# EAGLE board rgb-32x16-board (EAGLE 9.4.2), part 1 of 2
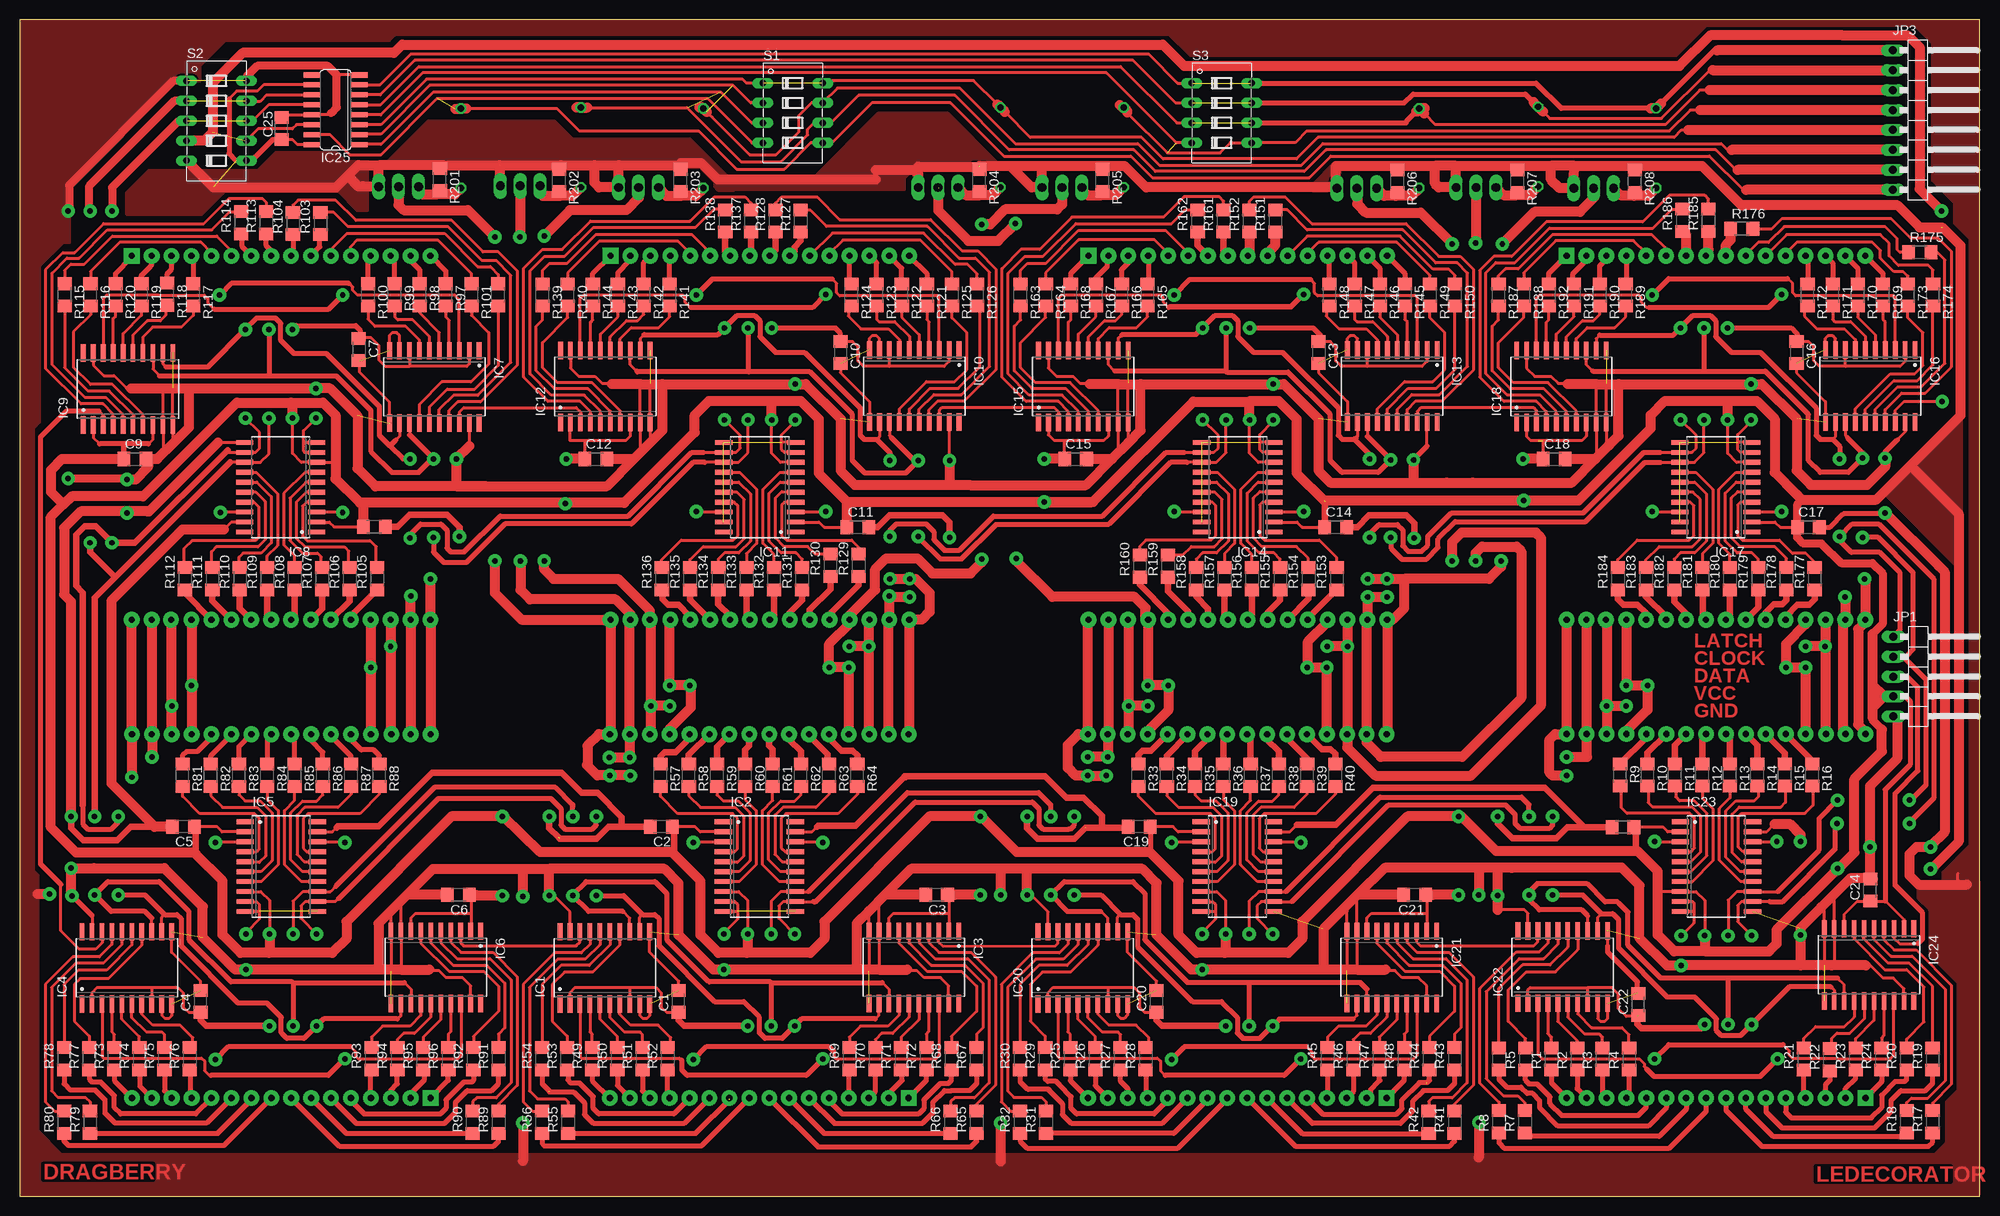
[diagram p2: board, top side]
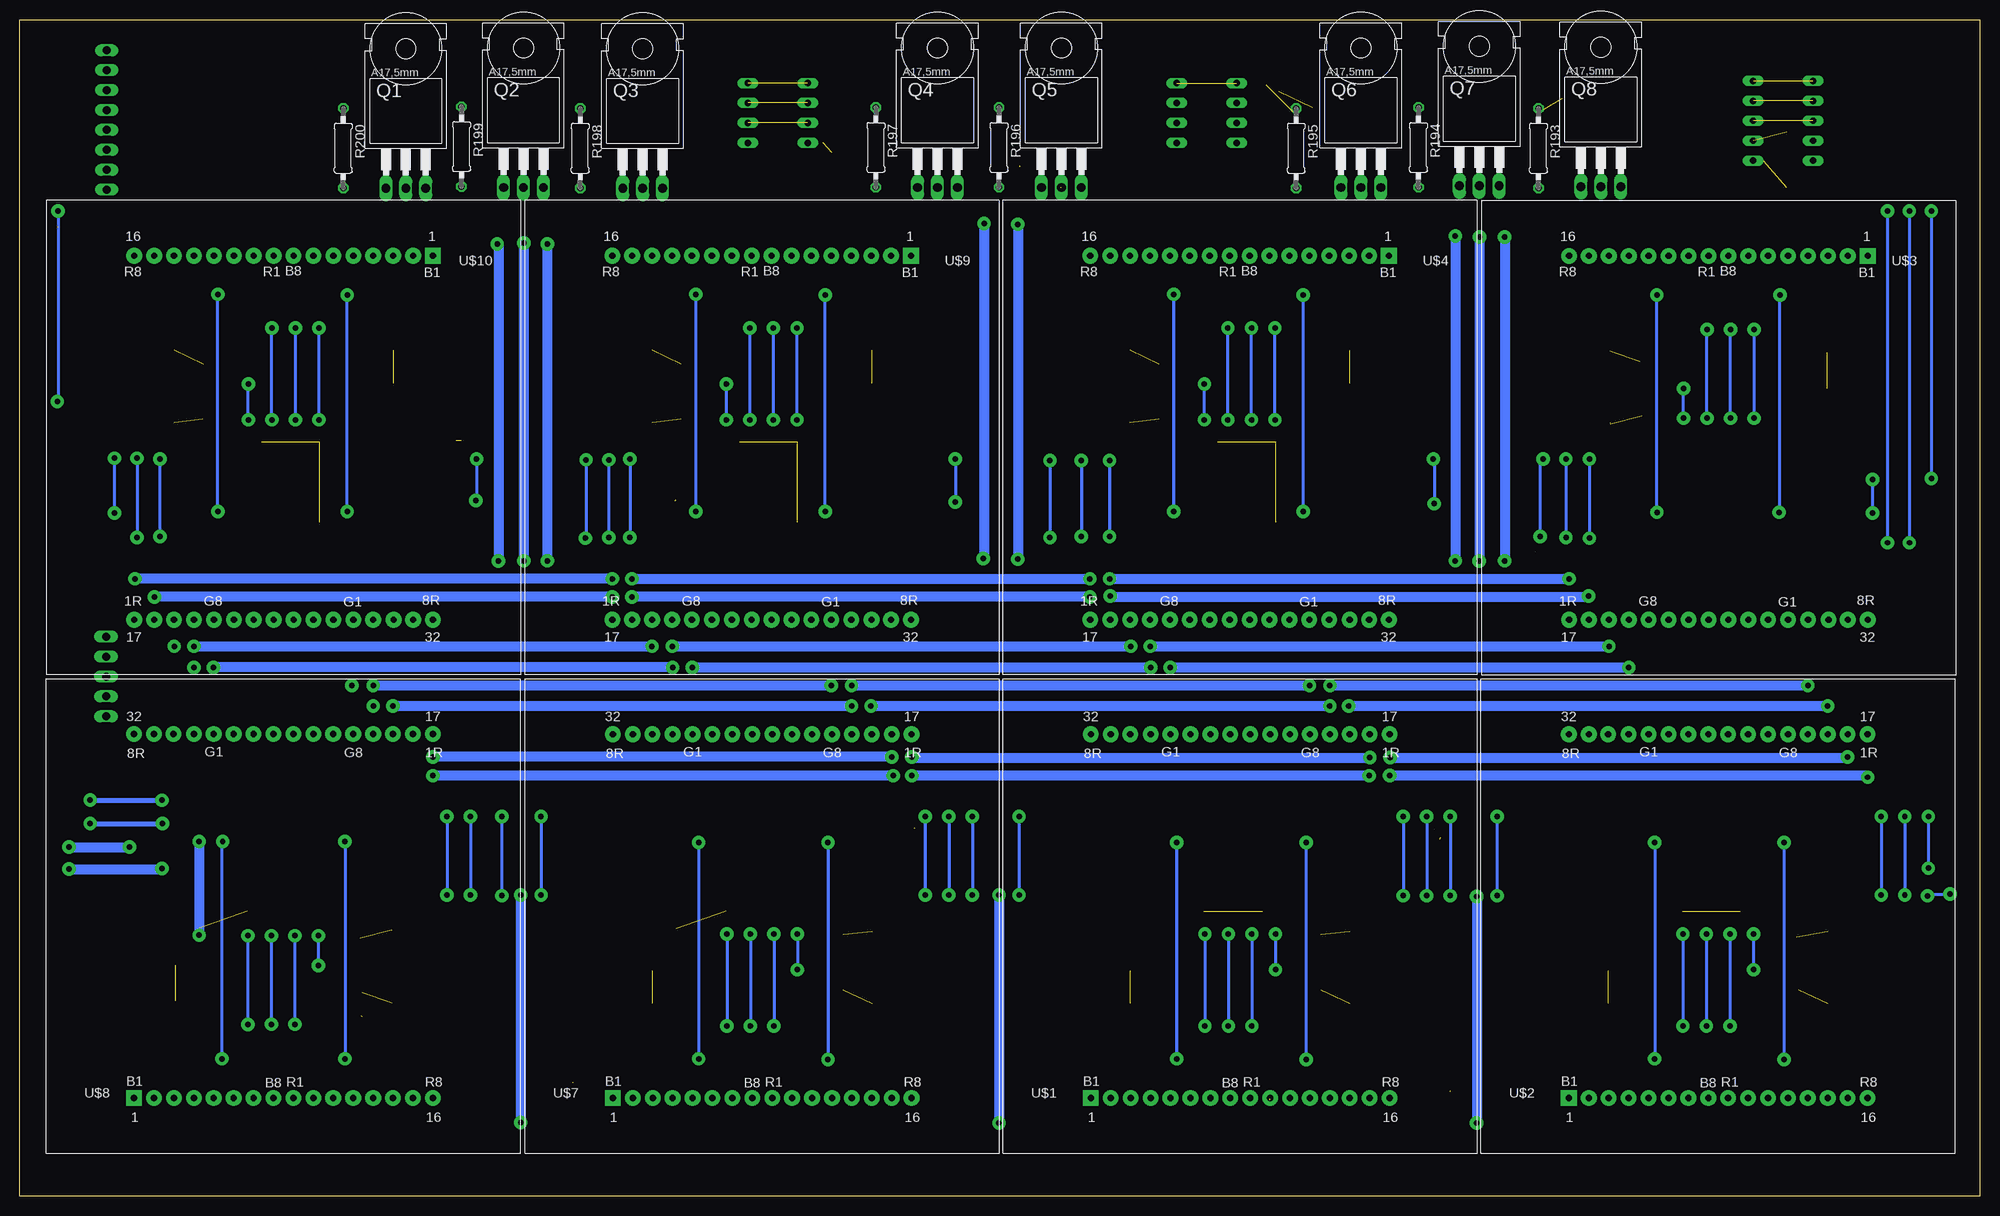
[diagram p3: board, bottom side, seen from below]

Size 250 x 150 mm. Coordinates in mm from the lower left corner, seen from the top.
Outline: 0,0 250,0 250,150 0,150 0,0
Copper layers (1*16): Top 0.035mm / dielectric 1.5mm / Bottom 0.035mm
Design rules "default *": minimum track width 0.3mm, minimum drill 0.7mm, track to track 0.3mm, track to pad 0.3mm, pad to pad 0.3mm, via to via 0.3mm, smd to smd 0.3mm, copper to edge 0mil, drill to drill 0.3mm, minimum pad ring 10mil, minimum via ring 0.5mm, stop-mask expansion 4mil, vias tented up to drill 0mil, thermal gap 10mil

## Footprints (pad centres in the part's own frame; a part is rotated, then mirrored left to right if it is on the bottom)
C1206 = smd 1.6 x 1.8: 1 -1.4,0; 2 1.4,0
SO20W = smd 0.6 x 2.2: 1 -5.715,-4.6; 2 -4.445,-4.6; 3 -3.175,-4.6; 4 -1.905,-4.6; 5 -0.635,-4.6; 6 0.635,-4.6; 7 1.905,-4.6; 8 3.175,-4.6; 9 4.445,-4.6; 10 5.715,-4.6; 11 5.715,4.6; 12 4.445,4.6; 13 3.175,4.6; 14 1.905,4.6; 15 0.635,4.6; 16 -0.635,4.6; 17 -1.905,4.6; 18 -3.175,4.6; 19 -4.445,4.6; 20 -5.715,4.6
SO16 = smd 0.66 x 2.032: 1 -4.445,-3.073; 2 -3.175,-3.073; 3 -1.905,-3.073; 4 -0.635,-3.073; 5 0.635,-3.073; 6 1.905,-3.073; 7 3.175,-3.073; 8 4.445,-3.073; 9 4.445,3.073; 10 3.175,3.073; 11 1.905,3.073; 12 0.635,3.073; 13 -0.635,3.073; 14 -1.905,3.073; 15 -3.175,3.073; 16 -4.445,3.073
1X05/90 = drill 1.016 long: 1 -5.08,-3.81; 2 -2.54,-3.81; 3 0,-3.81; 4 2.54,-3.81; 5 5.08,-3.81
1X08/90 = drill 1.016 long: 1 -8.89,-3.81; 2 -6.35,-3.81; 3 -3.81,-3.81; 4 -1.27,-3.81; 5 1.27,-3.81; 6 3.81,-3.81; 7 6.35,-3.81; 8 8.89,-3.81
TO220BH = drill 1.118 long: D 0,-6.35; G -2.54,-6.35; S 2.54,-6.35
R1206 = smd 1.6 x 1.803: 1 -1.422,0; 2 1.422,0
0207/10 = drill 0.813 octagon: 1 -5.08,0; 2 5.08,0
DIP04YL = drill 0.813 long: 1 -3.81,-3.81; 2 -1.27,-3.81; 3 1.27,-3.81; 4 3.81,-3.81; 5 3.81,3.81; 6 1.27,3.81; 7 -1.27,3.81; 8 -3.81,3.81
DIP05YL = drill 0.813 long: 1 -5.08,-3.81; 2 -2.54,-3.81; 3 0,-3.81; 4 2.54,-3.81; 5 5.08,-3.81; 6 5.08,3.81; 7 2.54,3.81; 8 0,3.81; 9 -2.54,3.81; 10 -5.08,3.81
2088-RGB-5 = drill 0.8 pad 2 square: P$1 0,0 | drill 0.8 pad 2: P$2 2.54,0; P$3 5.08,0; P$4 7.62,0; P$5 10.16,0; P$6 12.7,0; P$7 15.24,0; P$8 17.78,0; P$9 20.32,0; P$10 22.86,0; P$11 25.4,0; P$12 27.94,0; P$13 30.48,0; P$14 33.02,0; P$15 35.56,0; P$16 38.1,0; P$17 38.1,46.4; P$18 35.56,46.4; P$19 33.02,46.4; P$20 30.48,46.4; P$21 27.94,46.4; P$22 25.4,46.4; P$23 22.86,46.4; P$24 20.32,46.4; P$25 17.78,46.4; P$26 15.24,46.4; P$27 12.7,46.4; P$28 10.16,46.4; P$29 7.62,46.4; P$30 5.02,46.4; P$31 2.54,46.4; P$32 0,46.4

## Placement (x,y rotation side)
C1  [C1206]  84.05,24.84 90 top
C2  [C1206]  81.84,47.08 180 top
C3  [C1206]  116.94,38.4 180 top
C4  [C1206]  23.09,24.84 90 top
C5  [C1206]  20.88,47.08 180 top
C6  [C1206]  55.98,38.4 180 top
C7  [C1206]  43.26,107.96 270 top
C8  [C1206]  45.23,85.35 0 top
C9  [C1206]  14.7,93.98 0 top
C10  [C1206]  104.69,107.54 270 top
C11  [C1206]  106.9,85.3 0 top
C12  [C1206]  73.5,93.98 0 top
C13  [C1206]  165.65,107.54 270 top
C14  [C1206]  167.86,85.3 0 top
C15  [C1206]  134.66,93.98 0 top
C16  [C1206]  226.61,107.54 270 top
C17  [C1206]  228.12,85.3 0 top
C18  [C1206]  195.72,93.98 0 top
C19  [C1206]  142.8,47.08 180 top
C20  [C1206]  145.01,24.84 90 top
C21  [C1206]  177.9,38.4 180 top
C22  [C1206]  206.44,24.42 90 top
C23  [C1206]  204.47,47.03 180 top
C24  [C1206]  236,39 90 top
C25  [C1206]  33.4,136.1 90 top
IC1  TPIC6B595DW  [SO20W]  74.64,29.1 0 top
IC2  TPIC6B595DW  [SO20W]  94.34,42 270 top
IC3  TPIC6B595DW  [SO20W]  114.04,29.16 180 top
IC4  TPIC6B595DW  [SO20W]  13.68,29.1 0 top
IC5  TPIC6B595DW  [SO20W]  33.38,42 270 top
IC6  TPIC6B595DW  [SO20W]  53.08,29.16 180 top
IC7  TPIC6B595DW  [SO20W]  52.9,103.18 180 top
IC8  TPIC6B595DW  [SO20W]  33.3,90.38 90 top
IC9  TPIC6B595DW  [SO20W]  13.84,102.9 0 top
IC10  TPIC6B595DW  [SO20W]  114.1,103.28 180 top
IC11  TPIC6B595DW  [SO20W]  94.4,90.38 90 top
IC12  TPIC6B595DW  [SO20W]  74.7,103.22 0 top
IC13  TPIC6B595DW  [SO20W]  175.06,103.28 180 top
IC14  TPIC6B595DW  [SO20W]  155.36,90.38 90 top
IC15  TPIC6B595DW  [SO20W]  135.66,103.22 0 top
IC16  TPIC6B595DW  [SO20W]  236.02,103.28 180 top
IC17  TPIC6B595DW  [SO20W]  216.32,90.38 90 top
IC18  TPIC6B595DW  [SO20W]  196.62,103.22 0 top
IC19  TPIC6B595DW  [SO20W]  155.3,42 270 top
IC20  TPIC6B595DW  [SO20W]  135.6,29.1 0 top
IC21  TPIC6B595DW  [SO20W]  175,29.16 180 top
IC22  TPIC6B595DW  [SO20W]  196.8,29.2 0 top
IC23  TPIC6B595DW  [SO20W]  216.4,42 270 top
IC24  TPIC6B595DW  [SO20W]  235.86,29.48 180 top
IC25  74HC595D  [SO16]  40.3,138.5 90 top
JP1  [1X05/90]  242.77,66.24 270 top
JP3  [1X08/90]  242.7,137.2 270 top
Q1  IRF4905  [TO220BH]  200.74,134.85 0 bottom
Q2  IRF4905  [TO220BH]  185.74,134.95 0 bottom
Q3  IRF4905  [TO220BH]  170.54,134.85 0 bottom
Q4  IRF4905  [TO220BH]  132.94,134.95 0 bottom
Q5  IRF4905  [TO220BH]  117.14,134.95 0 bottom
Q6  IRF4905  [TO220BH]  78.94,134.95 0 bottom
Q7  IRF4905  [TO220BH]  63.84,135.15 0 bottom
Q8  IRF4905  [TO220BH]  48.34,135.05 0 bottom
R1  [R1206]  195.36,17.48 90 top
R2  [R1206]  198.66,17.48 90 top
R3  [R1206]  201.86,17.48 90 top
R4  [R1206]  205.26,17.48 90 top
R5  [R1206]  192.06,17.48 90 top
R6  [R1206]  188.66,17.48 90 top
R7  [R1206]  191.96,9.48 90 top
R8  [R1206]  188.66,9.48 90 top
R9  [R1206]  204.11,53.68 270 top
R10  [R1206]  207.61,53.68 270 top
R11  [R1206]  211.11,53.68 270 top
R12  [R1206]  214.61,53.68 270 top
R13  [R1206]  218.11,53.68 270 top
R14  [R1206]  221.61,53.68 270 top
R15  [R1206]  225.11,53.68 270 top
R16  [R1206]  228.61,53.68 270 top
R17  [R1206]  243.96,9.48 90 top
R18  [R1206]  240.66,9.48 90 top
R19  [R1206]  243.96,17.48 90 top
R20  [R1206]  240.66,17.48 90 top
R21  [R1206]  227.56,17.48 90 top
R22  [R1206]  230.86,17.38 90 top
R23  [R1206]  234.16,17.48 90 top
R24  [R1206]  237.46,17.48 90 top
R25  [R1206]  134,17.5 90 top
R26  [R1206]  137.2,17.5 90 top
R27  [R1206]  140.4,17.5 90 top
R28  [R1206]  143.6,17.5 90 top
R29  [R1206]  130.8,17.5 90 top
R30  [R1206]  127.6,17.5 90 top
R31  [R1206]  130.9,9.4 90 top
R32  [R1206]  127.6,9.4 90 top
R33  [R1206]  142.7,53.66 270 top
R34  [R1206]  146.3,53.66 270 top
R35  [R1206]  149.9,53.66 270 top
R36  [R1206]  153.5,53.66 270 top
R37  [R1206]  157,53.66 270 top
R38  [R1206]  160.6,53.66 270 top
R39  [R1206]  164.2,53.66 270 top
R40  [R1206]  167.8,53.66 270 top
R41  [R1206]  183,9.4 90 top
R42  [R1206]  179.7,9.4 90 top
R43  [R1206]  183,17.5 90 top
R44  [R1206]  179.8,17.5 90 top
R45  [R1206]  166.8,17.5 90 top
R46  [R1206]  170.1,17.5 90 top
R47  [R1206]  173.4,17.5 90 top
R48  [R1206]  176.6,17.5 90 top
R49  [R1206]  73.04,17.5 90 top
R50  [R1206]  76.24,17.5 90 top
R51  [R1206]  79.44,17.5 90 top
R52  [R1206]  82.64,17.5 90 top
R53  [R1206]  69.84,17.5 90 top
R54  [R1206]  66.64,17.5 90 top
R55  [R1206]  69.94,9.4 90 top
R56  [R1206]  66.64,9.4 90 top
R57  [R1206]  81.74,53.66 270 top
R58  [R1206]  85.34,53.66 270 top
R59  [R1206]  88.94,53.66 270 top
R60  [R1206]  92.54,53.66 270 top
R61  [R1206]  96.04,53.66 270 top
R62  [R1206]  99.64,53.66 270 top
R63  [R1206]  103.24,53.66 270 top
R64  [R1206]  106.84,53.66 270 top
R65  [R1206]  122.04,9.4 90 top
R66  [R1206]  118.74,9.4 90 top
R67  [R1206]  122.04,17.5 90 top
R68  [R1206]  118.84,17.5 90 top
R69  [R1206]  105.84,17.5 90 top
R70  [R1206]  109.14,17.5 90 top
R71  [R1206]  112.44,17.5 90 top
R72  [R1206]  115.64,17.5 90 top
R73  [R1206]  12.08,17.5 90 top
R74  [R1206]  15.28,17.5 90 top
R75  [R1206]  18.48,17.5 90 top
R76  [R1206]  21.68,17.5 90 top
R77  [R1206]  8.88,17.5 90 top
R78  [R1206]  5.68,17.5 90 top
R79  [R1206]  8.98,9.4 90 top
R80  [R1206]  5.68,9.4 90 top
R81  [R1206]  20.78,53.66 270 top
R82  [R1206]  24.38,53.66 270 top
R83  [R1206]  27.98,53.66 270 top
R84  [R1206]  31.58,53.66 270 top
R85  [R1206]  35.08,53.66 270 top
R86  [R1206]  38.68,53.66 270 top
R87  [R1206]  42.28,53.66 270 top
R88  [R1206]  45.88,53.66 270 top
R89  [R1206]  61.08,9.4 90 top
R90  [R1206]  57.78,9.4 90 top
R91  [R1206]  61.08,17.5 90 top
R92  [R1206]  57.88,17.5 90 top
R93  [R1206]  44.88,17.5 90 top
R94  [R1206]  48.18,17.5 90 top
R95  [R1206]  51.48,17.5 90 top
R96  [R1206]  54.68,17.5 90 top
R97  [R1206]  54.34,114.9 270 top
R98  [R1206]  51.04,114.9 270 top
R99  [R1206]  47.84,114.9 270 top
R100  [R1206]  44.44,114.9 270 top
R101  [R1206]  57.64,114.9 270 top
R102  [R1206]  61.04,114.9 270 top
R103  [R1206]  38.36,124 90 top
R104  [R1206]  34.86,124 90 top
R105  [R1206]  45.59,78.7 90 top
R106  [R1206]  42.09,78.7 90 top
R107  [R1206]  38.59,78.7 90 top
R108  [R1206]  35.09,78.7 90 top
R109  [R1206]  31.59,78.7 90 top
R110  [R1206]  28.09,78.7 90 top
R111  [R1206]  24.59,78.7 90 top
R112  [R1206]  21.09,78.7 90 top
R113  [R1206]  31.46,124.1 90 top
R114  [R1206]  28.26,124.1 90 top
R115  [R1206]  5.74,114.9 270 top
R116  [R1206]  9.04,114.9 270 top
R117  [R1206]  22.14,114.9 270 top
R118  [R1206]  18.84,115 270 top
R119  [R1206]  15.54,114.9 270 top
R120  [R1206]  12.24,114.9 270 top
R121  [R1206]  115.7,114.88 270 top
R122  [R1206]  112.5,114.88 270 top
R123  [R1206]  109.3,114.88 270 top
R124  [R1206]  106.1,114.88 270 top
R125  [R1206]  118.9,114.88 270 top
R126  [R1206]  122.1,114.88 270 top
R127  [R1206]  99.6,124.32 90 top
R128  [R1206]  96.4,124.32 90 top
R129  [R1206]  107,80.42 90 top
R130  [R1206]  103.4,80.42 90 top
R131  [R1206]  99.8,78.72 90 top
R132  [R1206]  96.2,78.72 90 top
R133  [R1206]  92.7,78.72 90 top
R134  [R1206]  89.1,78.72 90 top
R135  [R1206]  85.5,78.72 90 top
R136  [R1206]  81.9,78.72 90 top
R137  [R1206]  93.3,124.32 90 top
R138  [R1206]  90,124.32 90 top
R139  [R1206]  66.7,114.88 270 top
R140  [R1206]  69.9,114.88 270 top
R141  [R1206]  82.9,114.88 270 top
R142  [R1206]  79.6,114.88 270 top
R143  [R1206]  76.3,114.88 270 top
R144  [R1206]  73.1,114.88 270 top
R145  [R1206]  176.66,114.88 270 top
R146  [R1206]  173.46,114.88 270 top
R147  [R1206]  170.26,114.88 270 top
R148  [R1206]  167.06,114.88 270 top
R149  [R1206]  179.86,114.88 270 top
R150  [R1206]  183.06,114.88 270 top
R151  [R1206]  160.14,124.32 90 top
R152  [R1206]  156.84,124.32 90 top
R153  [R1206]  167.96,78.72 90 top
R154  [R1206]  164.36,78.72 90 top
R155  [R1206]  160.76,78.72 90 top
R156  [R1206]  157.16,78.72 90 top
R157  [R1206]  153.66,78.72 90 top
R158  [R1206]  150.06,78.72 90 top
R159  [R1206]  146.46,80.32 90 top
R160  [R1206]  142.86,80.32 90 top
R161  [R1206]  153.54,124.32 90 top
R162  [R1206]  150.24,124.32 90 top
R163  [R1206]  127.66,114.88 270 top
R164  [R1206]  130.86,114.88 270 top
R165  [R1206]  143.86,114.88 270 top
R166  [R1206]  140.56,114.88 270 top
R167  [R1206]  137.26,114.88 270 top
R168  [R1206]  134.06,114.88 270 top
R169  [R1206]  237.62,114.88 270 top
R170  [R1206]  234.42,114.88 270 top
R171  [R1206]  231.22,114.88 270 top
R172  [R1206]  228.02,114.88 270 top
R173  [R1206]  240.82,114.88 270 top
R174  [R1206]  244.02,114.88 270 top
R175  [R1206]  242.32,120.32 0 top
R176  [R1206]  219.62,123.32 0 top
R177  [R1206]  228.92,78.72 90 top
R178  [R1206]  225.32,78.72 90 top
R179  [R1206]  221.72,78.72 90 top
R180  [R1206]  218.12,78.72 90 top
R181  [R1206]  214.62,78.72 90 top
R182  [R1206]  211.02,78.72 90 top
R183  [R1206]  207.42,78.72 90 top
R184  [R1206]  203.82,78.72 90 top
R185  [R1206]  215.38,124.42 90 top
R186  [R1206]  212.08,124.42 90 top
R187  [R1206]  188.62,114.88 270 top
R188  [R1206]  191.82,114.88 270 top
R189  [R1206]  204.82,114.88 270 top
R190  [R1206]  201.52,114.88 270 top
R191  [R1206]  198.22,114.88 270 top
R192  [R1206]  195.02,114.88 270 top
R193  [0207/10]  56.3,133.6 270 bottom
R194  [0207/10]  71.6,133.7 270 bottom
R195  [0207/10]  87.2,133.6 270 bottom
R196  [0207/10]  125.1,133.7 270 bottom
R197  [0207/10]  140.8,133.7 270 bottom
R198  [0207/10]  178.5,133.6 270 bottom
R199  [0207/10]  193.64,133.81 270 bottom
R200  [0207/10]  208.72,133.61 270 bottom
R201  [R1206]  53.6,129.6 270 top
R202  [R1206]  68.8,129.5 270 top
R203  [R1206]  84.3,129.5 270 top
R204  [R1206]  122.4,129.5 270 top
R205  [R1206]  138.1,129.5 270 top
R206  [R1206]  175.7,129.4 270 top
R207  [R1206]  191,129.4 270 top
R208  [R1206]  206,129.4 270 top
S1  [DIP04YL]  98.6,138.1 270 top
S2  [DIP05YL]  25.1,137.1 270 top
S3  [DIP04YL]  153.3,138.1 270 top
U$1  2088-RGB-5DIP  [2088-RGB-5]  113.38,12.49 0 bottom
U$2  2088-RGB-5DIP  [2088-RGB-5]  52.42,12.49 0 bottom
U$3  2088-RGB-5DIP  [2088-RGB-5]  14.3,119.88 180 bottom
U$4  2088-RGB-5DIP  [2088-RGB-5]  75.36,119.89 180 bottom
U$7  2088-RGB-5DIP  [2088-RGB-5]  174.34,12.49 0 bottom
U$8  2088-RGB-5DIP  [2088-RGB-5]  235.4,12.5 0 bottom
U$9  2088-RGB-5DIP  [2088-RGB-5]  136.32,119.89 180 bottom
U$10  2088-RGB-5DIP  [2088-RGB-5]  197.28,119.89 180 bottom

## Tracks (layer width: path | path; a pad name or v marks a point on that pad's centre or on a via)
CLOCK  (via drill 0.7, 0.7 pad 1.3)  (1 unrouted)
  Top 0.406: IC24.13 232.69,26.95 231.84,27.8 | v217.9,33.2 217.9,37.73 219,38.83 IC23.13 224.2,38.83 | IC22.13 199.97,35.74 | v217.9,21.9 217.9,21.91 | 203.95,37.35 203.8,37.5 | 202.1,37.6 202.2,37.5 | 173.5,50.86 173.49,50.87 | 173.57,50.83 161.56,38.83 161.47,38.83 IC19.13 158.03,38.83 156.8,37.6 v156.8,33.4 | IC21.13 171.82,26.38 | IC20.13 138.78,35.42 137.9,36.3 | 133.6,36.3 133.61,36.3 | 100.61,38.83 IC2.13 97.06,38.83 95.84,37.6 v95.84,33.4 | IC3.13 110.86,26.38 110.04,27.2 | 95.84,27.2 95.74,27.3 | 87.82,27.42 87.94,27.3 | IC1.13 77.81,35.42 76.94,36.3 | 70.54,49.7 70.54,49.9 | 40.31,39.49 39.65,38.83 IC5.13 36.1,38.83 34.88,37.6 v34.88,33.4 | IC6.13 49.91,26.38 49.08,27.2 | 34.88,27.2 34.78,27.3 | IC4.13 16.86,35.42 | 11.69,36.3 v9.59,38.4 v9.58,38.4 | IC9.13 17.02,105.42 17.86,104.58 | v31.8,99.18 31.8,94.66 30.7,93.56 IC8.13 26.88,93.56 | IC7.13 49.73,97.04 | v31.8,110.48 31.8,110.47 | 87.4,93.56 IC11.13 91.67,93.56 92.9,94.78 v92.9,98.98 | 85.9,93.56 85.83,93.56 | IC12.13 77.88,106 78.7,105.18 92.9,105.18 93,105.08 | IC10.13 110.92,96.95 111.19,96.69 | 148.9,93.56 IC14.13 152.63,93.56 153.86,94.78 v153.86,98.98 | 138.92,85.68 138.84,85.6 | IC15.13 138.84,106 139.66,105.18 | IC13.13 171.88,96.86 | 209.3,93.56 IC17.13 213.59,93.56 214.82,94.78 v214.82,98.98 | IC18.13 199.79,106 200.62,105.18 | IC16.13 232.84,96.95 233.1,96.7 | 54.36,80.82 57.02,80.82 | S2.9 29.01,139.54 30.66,139.54 31.53,140.41 IC25.11 | 8.9,125.7 v9,125.6
  Top 0.61: 9.58,76.26 12.21,78.89 26.88,93.56 | v231.84,50.48 229.5,48.13 229.5,44.12 224.2,38.83 | v235.02,83.98 237.02,83.98 241.5,79.5 241.5,69.7 240.58,68.78 JP1.2 240.22,68.78 243.11,65.89 243.11,52.41 241.2,50.5 v241,50.5 | 100.61,38.83 113.21,51.43 129.97,51.43 131.5,49.9 v131.5,48.4 | 231.84,27.8 217.9,27.8 | 217.9,27.8 209.3,27.8 205.11,31.99 205.11,36.19 203.95,37.35 | 203.8,37.5 202.2,37.5 | 202.1,37.6 199.84,39.85 193.6,39.85 192.5,38.76 v192.5,38.4 192.5,37.8 193.8,36.5 199.22,36.5 199.97,35.74 | v217.9,21.9 217.9,27.8 | v192.5,48.4 192.5,49.9 191.53,50.87 173.49,50.87 | 161.47,38.83 173.5,50.86 | 171.82,26.38 171,27.2 156.8,27.2 | 156.8,27.2 v156.8,21.7 | 156.8,27.2 149,27.2 143.5,32.7 143.5,38.6 142,40.1 133.2,40.1 v131.5,38.4 v131.51,38.4 133.6,36.3 | 133.61,36.3 137.9,36.3 | v95.84,21.7 95.84,27.2 110.04,27.2 | 95.74,27.3 87.94,27.3 | 87.82,27.42 82.54,32.7 82.54,38.6 81.04,40.1 72.23,40.1 70.55,38.42 v70.55,38.3 72.55,36.3 76.94,36.3 | v70.54,48.4 70.54,49.7 | 70.54,49.9 68.34,52.1 52.92,52.1 40.31,39.49 | v34.88,21.7 34.88,27.2 49.08,27.2 | 34.78,27.3 26.98,27.3 21.58,32.7 21.58,36.3 17.78,40.1 11.27,40.1 11.27,40.09 v9.58,38.4 11.68,36.3 11.69,36.3 15.98,36.3 16.86,35.42 | v52.8,83.98 52.8,82.11 54.1,80.81 57,80.81 | 57.02,80.82 61.9,85.7 78.05,85.7 85.9,93.56 87.4,93.56 | 49.73,97.04 52.78,93.98 v52.8,93.98 52.6,93.98 50.9,92.28 47.5,92.28 44.8,94.98 44.8,100.18 40.4,104.58 31.8,104.58 | 17.86,104.58 31.8,104.58 | v31.8,110.48 31.8,104.58 | v92.9,110.68 92.9,105.18 | 78.7,105.18 78.8,105.08 93,105.08 100.8,105.08 106.2,99.68 106.2,93.78 107.8,92.18 113,92.18 v114.6,93.78 114.1,93.78 111.19,96.69
  Top 0.61: v114.6,84.08 117.43,81.25 120.15,81.25 124.5,85.6 138.84,85.6 | 148.9,93.56 146.79,93.56 138.92,85.68 | v153.86,110.68 153.86,105.18 | 153.86,105.18 139.66,105.18 | 153.86,105.18 153.97,105.07 161.77,105.07 167.16,99.68 167.16,93.78 168.66,92.28 173.26,92.28 v174.86,93.88 171.88,96.86 | v174.86,83.98 174.9,83.94 174.9,82.6 176.31,81.19 179.39,81.19 180.9,82.7 180.9,83.8 183.1,86 199.7,86 207.25,93.56 209.3,93.56 | v214.82,110.68 214.82,105.18 | 200.62,105.18 214.82,105.18 | 214.82,105.18 222.62,105.18 228.12,99.68 228.12,93.78 229.62,92.28 233.22,92.28 v235.02,94.08 235.02,94.78 233.1,96.7
  Top 0.813: v9.58,48.4 9.58,76.26 26.88,93.56 | v9,83.3 9,82.1 12.21,78.89
  Top 1.016: S2.2 19.74,139.64 8.9,128.8 8.9,125.7
  Bottom 0.406: v217.9,33.2 v217.9,21.9 | v192.5,48.4 v192.5,38.4 | v156.8,33.4 | v156.8,33.4 v156.8,21.7 | v131.5,48.4 v131.5,38.4 | v95.84,33.4 | v95.84,33.4 v95.84,21.7 | v70.54,48.4 v70.55,48.39 v70.55,38.3 | v34.88,33.4 | v34.88,33.4 v34.88,21.7 | v9.58,48.4 v9.58,38.4 | v31.8,99.18 v31.8,110.48 | v52.8,93.98 v52.8,83.98 | v92.9,98.98 | v92.9,98.98 v92.9,110.68 | v114.6,93.78 v114.6,84.08 | v153.86,98.98 | v153.86,98.98 v153.86,110.68 | v174.86,93.88 v174.86,83.98 | v214.82,98.98 | v214.82,98.98 v214.82,110.68 | v235.02,94.08 v235.02,83.98 | v9,125.6 v9,83.3
  Bottom 0.61: v241,50.5 240.4,50.5 240.38,50.48 v231.84,50.48
GND  (via drill 0.7, 0.7 pad 1.2, 0.7 pad 1.3)  (39 unrouted)
  Top 0.406: IC24.19 240.31,26.43 238.96,27.78 237.66,27.78 236.04,29.4 235.5,29.4 | 231.46,34.03 IC24.9 | 201.3,24.55 IC22.9 201.25,22.64 201.6,22.28 202.16,22.28 202.51,22.64 IC22.10 | 202.57,33.97 202.57,33.88 | IC24.9 231.41,29.71 231.1,29.4 | 230.15,29.4 IC24.10 230.15,36.45 229.77,36.83 | IC23.10 211.81,36.3 213.4,36.3 | 213.4,36.3 213.5,36.3 213.5,34.8 v211.9,33.2 | IC23.9 213.34,37.55 213.5,37.4 213.5,36.4 213.4,36.4 213.4,36.3 | IC22.11 202.51,31.9 | IC22.19 192.35,36.04 191.91,36.48 188.5,36.48 | IC24.9 231.41,38.09 | 170.56,38.06 IC21.9 170.56,28.86 | 169,28.71 169.28,28.71 IC21.10 169.28,36.31 168.92,36.68 | IC21.19 179.44,26.82 178.41,27.85 176.31,27.85 175.4,28.76 174.09,28.76 174.19,28.86 | 162.9,47.34 162,46.45 IC19.19 | IC20.9 140.04,23.05 140.4,22.7 140.9,22.7 141.3,23.1 141.3,24.48 IC20.10 | C20.2 145.01,27.39 141.31,31.09 IC20.11 | IC19.9 152.15,37.55 152.5,37.2 152.5,36.3 | 152.5,36.3 152.5,35.3 150.8,33.6 v150.8,33.4 | IC19.10 152.49,36.28 152.5,36.3 | IC20.19 131.16,36.24 129,38.4 v128.5,38.4 | 138.01,47.08 136.06,47.08 135.96,46.98 | 195.98,45.6 197.42,47.04 199.56,47.04 200.76,47.04 200.77,47.03 C23.2 | 109.59,38.06 IC3.9 109.59,28.86 | 108.04,28.71 108.33,28.71 IC3.10 108.33,36.31 108.31,36.33 | IC3.19 118.48,26.82 117.45,27.85 115.35,27.85 114.44,28.76 113.13,28.76 113.23,28.86 | 101.7,47.1 101.04,46.45 IC2.19 | 106.6,47.24 106.83,47.24 113.01,53.43 | IC1.9 79.08,23.05 79.44,22.7 80.04,22.7 80.36,23.02 IC1.10 | C1.2 84.05,27.39 80.36,31.09 IC1.11 | IC2.9 91.19,37.55 91.54,37.2 91.54,36.3 | 91.54,36.3 91.54,35.3 89.84,33.6 v89.84,33.4 | IC2.10 91.53,36.28 91.54,36.3
  Top 0.406: IC1.19 70.19,36.24 68.14,38.3 v67.56,38.3 | C2.2 80.2,47.08 76.8,47.08 75.1,47.08 | 73.81,45.79 73.61,45.59 73.6,45.58 68.86,45.58 68.85,45.59 | 48.63,38.06 IC6.9 48.63,28.86 | 47.08,28.71 47.37,28.71 IC6.10 47.37,36.31 47.35,36.33 | IC6.19 57.52,26.82 56.49,27.85 54.39,27.85 53.48,28.76 52.17,28.76 52.27,28.86 | 40.42,46.98 39.88,46.45 IC5.19 | IC4.9 18.12,23.05 18.48,22.7 19.08,22.7 19.39,23.02 IC4.10 | C4.2 23.09,27.39 19.39,31.09 IC4.11 | IC5.9 30.23,37.55 30.58,37.2 30.58,36.3 | 30.58,36.3 30.58,35.3 28.88,33.6 v28.88,33.4 | IC5.10 30.57,36.28 30.58,36.3 | 9.23,35.74 IC4.19 | IC9.19 9.39,105.94 10.74,104.6 12.04,104.6 13.66,102.98 14.2,102.98 | 18.24,98.34 IC9.9 | 17.39,93.98 17.39,93.75 | 48.4,107.83 IC7.9 48.45,109.74 48.09,110.1 47.54,110.1 47.19,109.75 IC7.10 | 47.12,98.42 47.12,98.5 | C9.2 16.16,93.92 | IC9.9 18.29,102.67 18.6,102.98 | 19.55,102.98 IC9.10 19.55,96.12 19.63,96.05 | IC8.10 37.88,96.08 36.3,96.08 | 36.3,96.08 36.2,96.08 36.2,97.58 v37.8,99.18 | IC8.9 36.35,94.83 36.2,94.98 36.2,95.98 36.3,95.98 36.3,96.08 | IC7.11 47.19,101.23 43.36,105.06 43.36,106.46 C7.2 | IC9.9 18.29,95 | 79.14,94.32 IC12.9 79.14,103.52 | 80.7,103.67 80.42,103.67 IC12.10 80.42,96.06 80.43,96.05 | IC12.19 70.25,105.56 71.29,104.53 73.39,104.53 74.3,103.62 75.61,103.62 75.51,103.52 | IC10.9 109.66,109.33 109.3,109.68 108.7,109.68 108.39,109.36 IC10.10 | C10.2 104.69,104.99 108.39,101.3 IC10.11 | IC11.9 97.56,94.83 97.2,95.18 97.2,96.08 | 97.2,96.08 97.2,97.08 98.9,98.78 v98.9,98.98 | IC11.10 97.22,96.09 97.2,96.08 | 140.1,94.32 IC15.9 140.1,103.52 | 141.66,103.67 141.38,103.67 IC15.10 141.38,96.06 141.39,96.05
  Top 0.406: IC15.19 131.22,105.56 132.25,104.53 134.35,104.53 135.26,103.62 136.57,103.62 136.47,103.52 | IC13.9 170.62,109.33 170.26,109.68 169.66,109.68 169.34,109.36 IC13.10 | C13.2 165.65,104.99 169.34,101.3 IC13.11 | IC14.9 158.51,94.83 158.16,95.18 158.16,96.08 | 158.16,96.08 158.16,97.08 159.86,98.78 v159.86,98.98 | IC14.10 158.18,96.09 158.16,96.08 | 179.5,95.62 IC13.19 | C14.2 170.2,85.3 | 201.06,94.32 IC18.9 201.06,103.52 | 202.62,103.67 202.34,103.67 IC18.10 202.34,96.06 202.7,95.7 | IC18.19 192.18,105.56 193.21,104.53 195.31,104.53 196.22,103.62 197.53,103.62 197.43,103.52 | IC16.9 231.57,109.33 231.22,109.68 230.62,109.68 230.31,109.36 IC16.10 | C16.2 226.61,104.99 230.31,101.3 IC16.11 | IC17.9 219.47,94.83 219.12,95.18 219.12,96.08 | 219.12,96.08 219.12,97.08 220.82,98.78 v220.82,98.98 | IC17.10 219.13,96.09 219.12,96.08 | IC16.19 240.47,97.42 239.47,96.43 | IC23.19 222.8,46.45 223.8,47.45 | IC8.19 27,85.94 26.07,85 | 11.7,75.9 11.7,75.5 | 11.75,52.55 11.7,52.6 | 25.3,96.1 IC8.11 | IC7.19 57.34,95.62 | IC25.8 40.45,142.94 | 39.73,138.07 39.55,137.9 37.26,137.9 IC25.13 33.77,137.87 C25.2 | v13.7,87.1 13.9,87.3 16.3,87.3 | v118.6,93.78 118.6,98.62 IC10.19 | 247.2,39.7 247.2,41.1
  Top 0.61: C17.2 230.9,85.3 232.58,86.98 237.82,86.98 v237.92,87.08 | 106.6,47.24 112.89,53.53 | C22.2 206.34,25.92 206.34,27.32 202.51,31.14 202.51,31.9 | v6.69,38.29 9.23,35.74 | v177.76,93.88 179.5,95.62 | v237.92,94.08 237.92,94.88 239.47,96.43
  Top 0.813: 101.7,47.1 101.84,47.24 106.6,47.24 112.78,53.43 113.01,53.43 | C19.2 141.3,46.98 137.91,46.98 | 137.91,46.98 138.01,47.08 138.01,48.49 135.7,50.8 133.5,50.8 130.77,53.53 112.89,53.53 | 137.91,46.98 135.96,46.98 | 135.89,46.91 134.56,45.58 129.82,45.58 128.5,46.9 v128.5,48.4 | 162.9,47.34 167.88,47.34 172.6,52.06 194.54,52.06 199.56,47.04 | C23.2 197.43,47.03 | 197.43,47.03 197.42,47.04 | 197.43,47.03 197.41,47.03 195.98,45.6 190.36,45.6 188.5,47.46 v188.5,48.4 | 40.42,46.98 40.58,47.15 45.77,47.15 52.62,54 69.1,54 71.7,51.4 73.7,51.4 76.8,48.3 76.8,47.08 | v67.54,48.4 67.54,46.9 68.72,45.72 | 68.85,45.59 73.61,45.59 | 73.81,45.79 75.1,47.08 80.2,47.08 | 17.22,47.08 14.14,47.08 12.44,45.38 8.1,45.38 6.58,46.9 v6.58,48.4 | C8.2 48.19,85.35 49.72,86.88 54.5,86.88 56.1,85.28 v56.1,84.08 | C11.2 109.44,85.3 110.94,86.8 117.7,86.8 118.6,85.9 v118.6,83.98 | v118.6,93.78 118.55,93.83 | C14.2 170.6,85.3 172.1,86.8 176.86,86.8 177.86,85.8 v177.86,83.88
  Top 1.016: v6.2,125.6 6.3,125.7 6.3,128.88 19.6,142.18 S2.1 | S2.10 28.91,142.71 30.3,144.1 39.3,144.1 40.45,142.94 40.45,138.81 39.73,138.07 | v6.2,91.5 13.57,91.5 v13.71,91.36
  Top 1.27: 235.5,29.4 231.1,29.4 230.15,29.4 227.1,29.4 | 227.1,29.4 v211.9,29.4 210.1,29.4 206.6,32.9 206.6,39.6 204.3,41.9 190.3,41.9 190.3,41.86 188.5,41.86 | 229.62,36.68 227.1,34.16 v227.1,33.27 227.1,29.4 | 188.5,41.86 v188.5,38.3 188.5,36.48 | 188.5,41.86 186.1,41.86 | 186.1,41.86 174.1,41.86 170.64,38.4 | 166.3,28.86 166.3,34.06 168.92,36.68 170.64,38.4 | 174.19,28.86 170.56,28.86 166.3,28.86 | C21.2 170.64,38.4 | 128.5,41.71 143.19,41.71 145,39.9 145,33.3 149.44,28.86 v150.8,28.86 166.3,28.86 | v128.5,38.4 128.5,41.71 | 128.5,41.71 128.5,41.73 125.1,41.73 | 125.1,41.73 113.71,41.73 110.38,38.4 | 106.74,28.86 106.74,34.76 108.31,36.33 110.38,38.4 | 113.23,28.86 109.59,28.86 106.74,28.86 | C3.2 110.38,38.4 | 67.56,41.71 82.23,41.71 84.04,39.9 84.04,33.3 88.48,28.86 v89.84,28.86 106.74,28.86 | v67.56,38.3 67.56,41.71 | 49.42,38.4 52.73,41.71 64.17,41.71 | 45.78,28.86 45.78,34.76 47.35,36.33 49.42,38.4 | 52.27,28.86 48.63,28.86 45.78,28.86 | C6.2 49.42,38.4 | 45.78,28.86 v28.88,28.86 27.52,28.86 23.38,33 23.38,36.9 18.47,41.81 9.49,41.81 9.48,41.8 v6.58,41.8 6.58,38.4 v6.69,38.29 | v13.71,91.36 14.78,91.36 16.4,92.98 16.4,93.98 C9.2 17.39,93.98 17.57,93.98 19.63,96.05 21.6,98.02 21.6,102.98 | 14.2,102.98 18.6,102.98 19.55,102.98 21.6,102.98 | 21.6,102.98 v37.8,102.98 39.6,102.98 43.1,99.48 43.1,92.78 45.4,90.48 59.4,90.48 59.4,90.52 | 57.34,95.62 v55.7,93.98 55.7,90.52 59.4,90.52 | 59.4,90.52 74.9,90.52 78.36,93.98 | 82,103.52 82,97.62 80.43,96.05 78.36,93.98 | 75.51,103.52 79.14,103.52 82,103.52 | C12.2 78.36,93.98 | 118.6,90.67 106.51,90.67 104.7,92.48 104.7,99.08 100.26,103.52 v98.9,103.52 82,103.52
  Top 1.27: 118.6,90.67 121.2,90.67 121.2,90.65 135.99,90.65 139.32,93.98 | v118.6,93.78 118.6,90.67 | 142.96,103.52 142.96,97.62 141.39,96.05 139.32,93.98 | 136.47,103.52 140.1,103.52 142.96,103.52 | C15.2 139.32,93.98 | 177.76,90.97 167.17,90.97 165.66,92.48 165.66,99.08 161.22,103.52 v159.86,103.52 142.96,103.52 | 177.76,90.97 185.31,90.97 | v177.76,93.88 177.76,90.97 | 181.99,90.95 197.95,90.95 200.98,93.98 | 203.92,103.52 203.92,96.92 202.7,95.7 200.98,93.98 | 197.43,103.52 201.06,103.52 203.92,103.52 | C18.2 200.98,93.98 | 203.92,103.52 v220.82,103.52 222.18,103.52 226.62,99.08 226.62,92.48 228.43,90.67 235.61,90.67 237.92,92.98 v237.92,94.08 | 11.7,75.9 20.8,85 26.07,85 | 11.7,75.5 11.7,52.6 | C5.2 17.22,47.08 11.75,52.55 | v6.58,48.4 6.58,75.8 5.68,76.7 5.68,85.18 7.8,87.3 16.3,87.3 16.5,87.3 25.3,96.1 | C24.2 236.39,40.4 | C24.2 236,40.5 | C24.2 235.89,40.51 233.45,40.51 229.77,36.83 | 64.17,41.71 67.56,41.71 | 223.8,47.45 225.75,47.45 227.1,46.1 v227.1,45.2 | 64.17,41.71 v64.17,38.2 | v64.2,9.3 64.2,4.5 | 186.1,41.86 v186.1,38.4 | v186.1,9.4 186.1,4.9 | 125.1,41.73 v125.1,38.4 | v125.1,9.3 125.1,4.4 | C24.2 v236,44.5 236,52.3 239.46,55.76 239.46,60.66 JP1.5 | 244.73,80.37 238.02,87.08 v237.92,87.08 | 244.73,80.37 244.73,80.35 | 244.73,80.37 245.5,79.6 245.5,46.4 243.7,44.6 v243.7,44.5 241.9,44.5 241,43.6 241,40.9 242.2,39.7 247.2,39.7 248.35,39.7 | v3.8,38.5 2.3,38.5
  Bottom 0.406: v211.9,33.2 v211.9,29.4 | v188.5,48.4 v188.5,38.3 | v150.8,33.4 v150.8,28.86 | v128.5,48.4 v128.5,38.4 | v89.84,33.4 v89.84,28.86 | v67.54,48.4 67.56,48.38 v67.56,38.3 | v28.88,33.4 v28.88,28.86 | v6.58,48.4 v6.58,41.8 | v37.8,99.18 v37.8,102.98 | v55.7,93.98 56.1,93.58 v56.1,84.08 | v98.9,98.98 v98.9,103.52 | v118.6,93.78 v118.6,83.98 | v159.86,98.98 v159.86,103.52 | v177.76,93.88 177.76,83.98 v177.86,83.88 | v220.82,98.98 v220.82,103.52 | v237.92,94.08 v237.92,87.08 | v13.7,87.1 v13.71,87.11 v13.71,91.36 | v6.2,125.6 v6.2,91.5 | v6.69,38.29 6.48,38.5 v3.8,38.5
  Bottom 1.27: v227.1,45.2 v227.1,33.27 | v64.2,9.3 64.17,9.33 v64.17,38.2 | v186.1,38.4 v186.1,9.4 | v125.1,38.4 v125.1,9.3 | v243.7,44.5 v236,44.5 235.9,44.5
  pour Top: 1.8,65.9 0.2,65.9 0.2,0.2 249.9,0.2 249.9,40.1 242.1,40.1 242.1,38 243.6,36.5 243.6,30.8 247.2,27.2 247.2,13.5 245.7,12 245.7,6.8 244.2,5.3 5.4,5.3 2.4,8.3 2.4,40.9 1.8,41.5
  pour Top: 1.8,66 1.8,97.9 2.6,98.7 2.6,118.6 5.6,121.6 6.4,121.6 6.4,125.5 6.5,125.6 6.5,128.5 20,142 22.8,142 23,142.2 23,144.1 28.7,149.8 0.2,149.8 0.2,66
  pour Top: 28.7,149.8 249.8,149.8 249.8,40.1 245.3,40.1 245.3,41.3 248.8,44.8 248.8,122 246.8,124 246.8,126.6 243.9,129.5 243.9,129.6 244,129.7 244,146.9 241.7,149.2 215.1,149.2 211.3,145.4 149.3,145.4 146.6,148.1 47.9,148.1 47.1,147.3 24.2,147.3
LATCH  (via drill 0.7, 0.7 pad 1.3)  (3 unrouted)
  Top 0.406: IC24.12 231.41,26.28 231.01,26.68 | v220.9,33.2 219.1,35 219.1,37.05 219.6,37.55 IC23.12 223.2,37.55 | IC22.12 201.25,35.52 201.72,35.99 | 162.24,37.55 IC19.12 158.35,37.55 157.8,37 157.8,35.4 v159.8,33.4 | 160.65,22.55 160.7,22.6 | 170.1,22.6 170.56,23.05 IC21.12 | IC20.12 140.04,35.55 140.4,35.9 | 156,20.1 156.2,20.1 | 133.8,46.78 133.99,46.78 | 101.23,37.55 IC2.12 97.39,37.55 96.84,37 96.84,35.4 v98.84,33.4 | 109.14,22.6 109.59,23.05 IC3.12 | IC1.12 79.08,35.55 79.44,35.9 | 94.34,22.6 94.34,22.8 | 98.72,21.58 97.24,20.1 | 40.66,37.94 40.27,37.55 IC5.12 36.44,37.55 35.88,37 35.88,35.4 v37.88,33.4 | 38.78,22.6 v37.88,21.7 37.69,21.51 36.28,20.1 | 48.18,22.6 48.63,23.05 IC6.12 | IC4.12 18.12,35.55 18.48,35.9 | 33.49,20.69 33.38,20.8 | IC9.12 18.29,106.1 18.68,105.7 | v28.8,99.18 30.6,97.38 30.6,95.33 30.1,94.83 IC8.12 26.45,94.83 | IC7.12 48.45,96.86 47.98,96.39 | 87.2,94.83 IC11.12 91.34,94.83 91.9,95.38 91.9,96.98 v89.9,98.98 | 89.06,109.84 v89.9,110.68 90.01,110.79 91.5,112.28 | 79.6,109.78 79.14,109.33 IC12.12 | IC10.12 109.66,96.83 109.3,96.48 | 148.5,94.83 IC14.12 152.31,94.83 152.86,95.38 152.86,96.98 v150.86,98.98 | 140.56,109.78 140.1,109.33 IC15.12 | IC13.12 170.62,96.83 170.44,96.66 | 170.26,96.48 172.16,94.58 | 209.2,94.83 IC17.12 213.26,94.83 213.82,95.38 213.82,96.98 v211.82,98.98 | 201.52,109.78 201.06,109.33 IC18.12 | IC16.12 231.57,96.83 231.22,96.48 | 176.4,82.9 177.1,82.2 | 199.4,87.1 182.6,87.1 | 118,82.3 119.8,82.3 119.85,82.35 | S2.8 29.7,137.1 31.8,139.2 37.16,139.2 IC25.12
  Top 0.61: 8.07,49.8 8.07,47.41 8.68,46.8 11.7,46.8 12.58,47.68 v12.58,48.4 | 223.2,37.55 224.85,37.55 231.5,44.2 231.5,47.2 v231.8,47.5 | JP1.1 239.76,72.12 239.76,79.54 237.22,82.08 233.62,82.08 232.12,83.58 v232.12,84.08 233.74,85.7 237.1,85.7 244.1,78.7 244.1,50.7 241,47.6 v241,47.5 | 101.23,37.55 101.52,37.55 114.2,50.24 129.16,50.24 129.99,49.41 129.99,47.31 130.52,46.78 133.8,46.78 | 133.99,46.78 134.5,47.29 v134.5,48.4 | 231.01,26.68 225.7,26.68 v220.9,21.88 219.47,20.45 217.06,20.45 216.4,21.1 216.4,22.6 213.62,25.38 210.16,25.38 203.9,31.64 203.9,35.27 203.17,36.01 201.71,36.01 | v195.5,38.4 199.31,38.4 201.71,36.01 | 201.72,35.99 201.71,36.01 | v195.5,48.4 195.5,47.25 195.09,46.84 191.42,46.84 190.71,47.55 190.71,48.67 189.49,49.89 174.57,49.89 162.24,37.55 | v134.5,38.4 137.9,38.4 140.4,35.9 142,35.9 142.59,35.31 142.59,31.81 149.6,24.8 153.3,24.8 155.3,22.8 155.3,20.8 156,20.1 | 156.2,20.1 158.2,20.1 v159.8,21.7 160.65,22.55 | 160.7,22.6 170.1,22.6 | 109.14,22.6 99.74,22.6 98.72,21.58 | v98.84,21.7 97.24,20.1 95.04,20.1 94.34,20.8 94.34,22.6 | 94.34,22.8 92.34,24.8 88.64,24.8 81.54,31.9 81.54,35.4 81.04,35.9 79.44,35.9 77.05,38.3 v73.54,38.3 | 69.56,46.8 69.54,46.8 69.03,47.31 69.03,49.41 67.74,50.7 53.42,50.7 40.66,37.94 | 69.56,46.78 73.03,46.78 73.54,47.29 v73.54,48.4 | 48.18,22.6 38.78,22.6 37.69,21.51 | v37.88,21.7 36.28,20.1 34.08,20.1 33.49,20.69 | 33.38,20.8 33.38,22.8 31.54,24.64 27.84,24.64 20.58,31.9 20.58,35.4 20.08,35.9 18.48,35.9 15.98,38.4 v12.58,38.4 | v49.8,83.88 49.8,84.34 51.13,85.67 53.73,85.67 54.5,84.9 54.5,82.6 54.97,82.13 56.72,82.13
  Top 0.61: 56.72,82.12 61.3,86.7 77.58,86.7 85.7,94.83 87.2,94.83 | v49.8,93.98 48.88,93.98 47.23,95.63 | 47.23,95.63 45.9,96.97 45.9,100.64 39.14,107.4 35,107.4 33.3,109.1 33.3,111.28 32.65,111.94 30.23,111.94 v28.8,110.5 24,105.7 18.68,105.7 | 47.23,95.63 47.23,95.64 47.98,96.39 | 79.6,109.78 79.66,109.84 89.06,109.84 90.01,110.79 | v89.9,110.68 91.5,112.28 93.7,112.28 94.4,111.58 94.4,109.58 96.4,107.58 100.1,107.58 107.2,100.48 107.2,96.98 107.7,96.48 109.3,96.48 111,94.78 v111,93.78 | v111,84.08 111,84.89 111.81,85.7 115.6,85.7 116.6,84.7 116.6,83.7 118,82.3 118.05,82.35 119.85,82.35 124.2,86.7 138.07,86.7 146.2,94.83 148.5,94.83 | 140.56,109.78 140.64,109.86 150.04,109.86 v150.86,110.68 152.46,112.28 154.66,112.28 155.36,111.58 155.36,109.58 157.36,107.58 161.06,107.58 168.16,100.48 168.16,96.98 168.66,96.48 170.26,96.48 170.39,96.61 | 170.39,96.61 170.44,96.66 | 170.39,96.61 170.39,96.35 172.16,94.58 v172.16,93.98 | v172.16,83.98 172.16,84.39 173.37,85.6 175.74,85.6 176.4,84.94 176.4,82.9 176.99,82.31 177,82.31 | 177.1,82.2 178.8,82.2 179.6,83 179.6,84.1 182.6,87.1 182.61,87.1 182.62,87.11 183.38,87.11 183.39,87.1 199.4,87.1 207.12,94.83 209.2,94.83 | 201.52,109.78 210.92,109.78 v211.82,110.68 213.42,112.28 215.62,112.28 216.32,111.58 216.32,109.58 218.32,107.58 222.02,107.58 229.12,100.48 229.12,96.98 229.62,96.48 231.22,96.48 232.12,95.58 v232.12,93.98
  Top 0.813: 8.07,49.8 8.07,76.95 7.2,77.82 7.2,84.3 8.3,85.4 9.7,85.4 v11.8,83.3 14.7,83.3 26.52,95.12
  Top 1.016: v11.8,125.6 11.8,128.6 20.3,137.1 S2.3
  Bottom 0.406: v220.9,33.2 v220.9,21.88 | v195.5,48.4 v195.5,38.4 | v159.8,33.4 v159.8,21.7 | v159.8,21.7 | v134.5,48.4 v134.5,38.4 | v98.84,33.4 v98.84,21.7 | v98.84,21.7 | v73.54,48.4 v73.54,38.3 | v37.88,33.4 v37.88,21.7 | v37.88,21.7 | v12.58,48.4 v12.58,38.4 | v28.8,99.18 v28.8,110.5 | v49.8,93.98 v49.8,83.88 | v89.9,98.98 v89.9,110.68 | v89.9,110.68 | v111,93.78 v111,84.08 | v150.86,98.98 v150.86,110.68 | v150.86,110.68 | v172.16,93.98 v172.16,83.98 | v211.82,98.98 v211.82,110.68 | v211.82,110.68 | v232.12,93.98 v232.12,84.08 | v11.8,125.6 v11.8,83.3
  Bottom 0.61: v241,47.5 v231.8,47.5
N$1
  Top 0.61: R1.1 195.36,14.44 U$8.P$16
N$2
  Top 0.406: 201.86,13.02 U$8.P$14
  Top 0.61: R3.1 201.86,13.02
N$3
  Top 0.406: 192.56,14.28 193.54,14.28
  Top 0.61: 193.84,13.98 195.16,12.66 195.16,11.78 196.66,10.28 206.42,10.28 207.46,11.32 U$8.P$12 | 193.84,13.98 193.54,14.28 | 193.84,13.98 193.85,13.98 193.54,14.29 192.56,14.29 | 192.56,14.28 192.06,14.78 R5.1
N$4
  Top 0.406: R7.1 191.96,7.63 192.2,7.63
  Top 0.61: U$8.P$10 212.54,11.07 209.1,7.63 192.2,7.63
N$5
  Top 0.813: R9.1 207.46,58.45 U$8.P$21
N$6
  Top 0.813: R11.1 211.11,57.47 U$8.P$23
N$7
  Top 0.813: R13.1 218.11,58.41 U$8.P$25
N$8
  Top 0.813: U$8.P$27 225.11,56.49 R15.1
N$9
  Top 0.406: IC22.17 194.9,32.21 193.81,31.13 190.91,31.13 186.26,26.48 186.26,14.38 188.66,11.98 R8.2
N$10
  Top 0.406: IC22.16 196.16,32.09 194.37,30.29 191.27,30.29 187.06,26.08 187.06,14.98 189.26,12.78 191.06,12.78 191.96,11.88 R7.2
N$11
  Top 0.406: IC22.15 197.44,31.75 195.16,29.48 191.66,29.48 188.66,26.48 R6.2
N$12
  Top 0.406: IC22.14 198.71,31.43 195.86,28.58 192.13,28.58 189.86,26.3 189.86,22.28 192.06,20.08 R5.2
N$13
  Top 0.406: IC22.7 198.71,23.24 200.47,21.48 204.36,21.48 205.26,20.58 R4.2 205.26,19.38
N$14
  Top 0.406: IC22.6 197.44,22.8 199.56,20.68 201.46,20.68 201.86,20.28 R3.2
N$15
  Top 0.406: IC22.5 196.16,22.27 198.66,19.78 R2.2
N$16
  Top 0.406: IC22.4 194.9,20.74 195.36,20.27 R1.2
N$17
  Top 0.406: R9.2 204.21,52.16 204.21,49.59 205,48.8 213,48.8 213.6,48.2 213.6,44.4 213.1,43.91 IC23.4
N$18
  Top 0.406: IC23.5 213.13,42.63 214.4,43.9 214.4,48.5 213.3,49.6 208.27,49.6 207.71,50.16 207.71,52.16 R10.2
N$19
  Top 0.406: IC23.6 213.16,41.37 215.2,43.4 215.2,48.8 213.6,50.4 211.7,50.4 211.21,50.89 211.21,52.16 R11.2
N$20
  Top 0.406: IC23.7 213.29,40.09 216,42.8 216,49.34 214.61,50.73 R12.2
N$21
  Top 0.406: IC23.14 219.5,40.09 216.79,42.81 216.79,49.44 218.11,50.76 R13.2
N$22
  Top 0.406: IC23.15 219.44,41.37 217.6,43.2 217.6,49.1 218.9,50.4 221.2,50.4 221.71,50.91 221.71,52.16 R14.2
N$23
  Top 0.406: IC23.16 220.97,42.6 219.6,42.6 218.4,43.8 218.4,48.7 219.3,49.6 224.6,49.6 225.21,50.21 225.21,52.16 R15.2
N$24
  Top 0.406: 228.61,52.16 R16.2 228.71,52.16 228.71,49.81 227.7,48.8 219.6,48.8 219.2,48.4 219.2,44.5 219.79,43.91 IC23.17
N$25
  Top 0.406: IC24.4 237.76,32.67 239.06,31.38 241.86,31.38 246.41,26.83 246.41,14.3 243.96,11.85 R17.2
N$26
  Top 0.406: IC24.5 236.5,32.74 238.66,30.58 241.36,30.58 245.56,26.38 245.56,14.7 243.36,12.5 241.26,12.5 240.66,11.9 R18.2
N$27
  Top 0.406: IC24.6 235.17,34.02 235.17,32.83 238.25,29.75 240.96,29.75 243.96,26.74 R19.2
N$28
  Top 0.406: IC24.7 233.96,32.78 237.86,28.88 240.66,28.88 242.86,26.68 242.86,22.2 240.66,20 R20.2
N$29
  Top 0.406: R21.2 227.56,20.1 229.06,21.6 232.73,21.6 233.96,22.83 IC24.14
N$30
  Top 0.406: R22.2 231.08,19.02 231.08,20.1 231.76,20.78 233.43,20.78 235.22,22.58 IC24.15
N$31
  Top 0.406: R23.2 234.16,20.08 236.5,22.41 IC24.16
N$32
  Top 0.406: IC24.17 237.76,20.48 237.46,20.18 R24.2
N$33
  Top 0.61: U$8.P$8 217.62,10.92 222.19,6.35 243.43,6.35 243.96,6.88 R17.1
N$34
  Top 0.406: 239.84,13.36 239.16,12.68
  Top 0.61: U$8.P$6 222.7,10.74 224.76,8.68 236.56,8.68 238.67,10.79 238.67,12.19 239.84,13.36 239.94,13.46 243.06,13.46 243.96,14.36 R19.1
N$35
  Top 0.61: U$8.P$4 227.56,12.72 R21.1
N$36
  Top 0.61: U$8.P$2 232.86,13.72 234.16,15.02 R23.1
N$37
  Top 0.406: 198.66,13.8 198.66,13.68
  Top 0.61: R2.1 198.66,13.8 | 198.66,13.68 U$8.P$15
N$38
  Top 0.61: U$8.P$13 205.22,12.8 205.22,16.02 R4.1
N$39
  Top 0.406: 189.66,13.88 188.66,14.88
  Top 0.61: U$8.P$11 210,11.23 207.7,8.93 196.21,8.93 193.86,11.28 193.86,12.18 192.96,13.08 192.26,13.08 191.46,13.88 189.66,13.88 | R6.1 188.66,14.88 189.65,13.89 189.66,13.89
N$40
  Top 0.61: R8.1 188.66,6.78 189.31,6.13 210.41,6.13 215.08,10.8 U$8.P$9
N$41
  Top 0.813: U$8.P$22 207.61,56.51 R10.1
N$42
  Top 0.813: R12.1 214.61,58.43 U$8.P$24
N$43
  Top 0.813: R14.1 221.61,57.45 U$8.P$26
N$44
  Top 0.813: U$8.P$28 228.61,55.53 R16.1
N$45
  Top 0.61: R18.1 240.17,7.57 223.67,7.57 220.16,11.08 U$8.P$7
N$46
  Top 0.406: 225.24,11.9 U$8.P$5
  Top 0.61: U$8.P$5 225.24,10.7 225.96,9.98 236.16,9.98 237.46,11.28 237.46,12.88 239.16,14.58 240.36,14.58 240.66,14.88 R20.1
N$47
  Top 0.406: U$8.P$3 230.3,12.52
  Top 0.61: R22.1 230.86,14.76 230.3,14.2 230.3,12.52
N$48
  Top 0.406: U$8.P$1 235.4,12.7 237.46,14.76
  Top 0.61: R24.1 237.46,14.76 237.46,14.56 U$8.P$1
N$49
  Top 0.406: IC22.18 193.62,32.42 193.06,31.86 178.7,31.86 178.18,32.38 IC21.3
N$50  (via drill 0.7 pad 1.3)
  Top 0.406: IC22.3 193.62,18.07 194.2,17.5 206.6,17.5 207.2,16.9 207.2,16.5 207.5,16.2 | IC23.18 221.03,45.2 v224.1,45.2
  Top 0.61: 207.5,16.2 208.46,15.24 221.94,15.24 v224.2,17.5
  Bottom 0.406: v224.1,45.2 224.2,45.1 v224.2,17.5
N$51
  Top 0.406: IC20.17 133.69,32.09 132.6,31 129.2,31 125.2,27 125.2,12 126.38,10.82 R32.2
N$52  (via drill 0.7 pad 1.3)
  Top 0.406: IC23.3 208.7,45.17 208.68,45.2 v208.5,45.2 | IC24.18 239.03,17.93 238.6,17.5 231.97,17.5 226.15,17.5 225.7,17.95 225.7,18.5 224.9,19.3
  Top 0.61: v208.5,17.5 210.3,19.3 224.9,19.3
  Bottom 0.406: v208.5,45.2 v208.5,17.5
N$53
  Top 0.406: IC24.3 239.03,32.91 239.76,32.18 242.1,32.18
  Top 0.61: JP1.3 240.76,66.24 242.1,64.9 242.1,54.2 239.2,51.3 239.2,39.61 242.7,36.11 242.7,32.78 242.1,32.18
N$54
  Top 0.406: IC20.16 134.97,32.06 133.1,30.2 129.6,30.2 126,26.6 126,13.4 126.8,12.6 130.3,12.6 130.9,12 R31.2
N$55
  Top 0.406: IC20.15 136.24,32.03 133.6,29.4 130,29.4 127.6,27 R30.2
N$56
  Top 0.406: IC20.14 137.5,32 134.04,28.54 130.44,28.54 128.9,27 128.9,22.3 130.8,20.4 R29.2
N$57
  Top 0.406: R28.2 144,19.32 144,20.2 142.4,21.8 138.9,21.8 137.5,23.2 IC20.7
N$58
  Top 0.406: R27.2 140.4,20.6 140.1,20.9 138.1,20.9 136.24,22.77 IC20.6
N$59
  Top 0.406: R26.2 137.2,20.32 134.97,22.56 IC20.5
N$60
  Top 0.406: R25.2 134,20.62 133.69,20.93 IC20.4
N$61
  Top 0.406: IC19.4 152.15,43.91 152.5,44.26 152.5,48.16 151.9,48.76 144.9,48.76 142.7,50.96 R33.2
N$62
  Top 0.406: R34.2 146.3,51.06 147.79,49.57 152.19,49.57 153.3,48.46 153.3,43.36 152.5,42.56 150.78,42.56 IC19.5
N$63
  Top 0.406: R35.2 149.9,51.16 150.69,50.37 152.59,50.37 154.1,48.86 154.1,42.76 152.71,41.37 IC19.6
N$64
  Top 0.406: R36.2 153.5,50.56 154.91,49.15 154.91,42.27 152.74,40.09 IC19.7
N$65
  Top 0.406: IC19.14 157.87,40.09 155.7,42.26 155.7,49.16 157,50.46 R37.2
N$66
  Top 0.406: IC19.15 158,41.37 156.5,42.86 156.5,48.86 158.01,50.37 159.8,50.37 160.6,51.17 R38.2
N$67
  Top 0.406: R39.2 164.2,51.24 162.52,49.56 158.3,49.56 157.3,48.56 157.3,43.56 158.22,42.63 IC19.16
N$68
  Top 0.406: R40.2 167.8,51.24 165.32,48.76 158.7,48.76 158.1,48.16 158.1,44.36 158.56,43.91 IC19.17
N$69
  Top 0.406: IC21.4 176.91,32.35 178.2,31.06 182.3,31.06 185.4,27.96 185.4,14.12 183,11.72 R41.2
N$70
  Top 0.406: IC21.5 175.63,32.33 177.7,30.26 181.9,30.26 184.6,27.56 184.6,14.43 182.71,12.54 180.18,12.54 179.7,12.06 R42.2
N$71
  Top 0.406: IC21.6 174.37,32.3 177.2,29.46 181.5,29.46 183.8,27.16 183.8,21.46 183,20.66 R43.2
N$72
  Top 0.406: IC21.7 173.09,32.27 176.7,28.66 181.1,28.66 183,26.76 183,23.56 179.8,20.36 R44.2
N$73
  Top 0.406: IC21.14 173.09,23.05 171.7,21.66 168.2,21.66 166.8,20.26 R45.2
N$74
  Top 0.406: IC21.15 174.37,22.82 172.3,20.76 170.9,20.76 170.1,19.96 R46.2
N$75
  Top 0.406: IC21.16 175.63,22.5 173.4,20.26 R47.2
N$76
  Top 0.406: IC21.17 176.91,20.96 176.6,20.66 R48.2
N$77
  Top 0.61: R25.1 134,14.73 U$7.P$16
N$78
  Top 0.61: R27.1 140.4,14.61 141.32,13.69 U$7.P$14
N$79
  Top 0.406: 131.19,14.71 132.09,14.71 132.7,14.1
  Top 0.61: U$7.P$12 146.4,12.19 144.7,10.49 134.81,10.49 134.11,11.19 134.11,12.69 132.7,14.1 132.19,14.61 131.09,14.61 130.8,14.9 R29.1
N$80
  Top 0.406: R31.1 131.04,7.98 131.02,8
  Top 0.61: U$7.P$10 151.48,12.29 147.19,8 131.02,8
N$81
  Top 0.813: R33.1 142.7,56.28 143.21,56.79 144.3,56.79 U$7.P$21
N$82
  Top 0.813: R35.1 149.9,56.71 151.48,58.29 U$7.P$23
N$83
  Top 0.813: R37.1 157,58.45 U$7.P$25
N$84
  Top 0.813: U$7.P$27 161.64,58.39 164.2,55.83 R39.1
N$85
  Top 0.406: 183,7.7 R41.1
  Top 0.61: U$7.P$8 162.69,6.36 182.4,6.36 183,6.96 183,7.7
N$86
  Top 0.61: U$7.P$6 164.87,9.26 176.1,9.26 177.7,10.86 177.7,12.15 179,13.45 182.12,13.45 183,14.34 R43.1
N$87
  Top 0.61: R45.1 166.8,12.57 U$7.P$4
N$88
  Top 0.406: 173.32,14.58 173.5,14.76 173.5,15.98 R47.1
  Top 0.61: U$7.P$2 172.32,13.01 172.32,13.58 173.32,14.58 | 173.5,14.76 173.4,14.86 R47.1
N$89
  Top 0.61: R26.1 137.2,14.07 U$7.P$15
N$90
  Top 0.61: R28.1 143.66,16.02 143.66,12.69 U$7.P$13
N$91
  Top 0.406: 127.6,14.57 128.57,13.6 131.3,13.6 131.3,13.5 | 148.88,12.43 U$7.P$11
  Top 0.61: R30.1 127.6,14.6 | 127.6,14.6 127.6,14.57 | 127.6,14.6 128.49,13.71 128.5,13.71 128.61,13.6 131.3,13.6 | 131.3,13.5 133,11.8 133,10.4 134.1,9.3 145.75,9.3 148.88,12.43
N$92
  Top 0.406: 154.02,12.42 U$7.P$9
  Top 0.61: R32.1 127.6,7 128.5,6.1 147.7,6.1 154.02,12.42
N$93
  Top 0.406: 148.94,58.8 U$7.P$22
  Top 0.813: R34.1 146.3,56.16 148.94,58.8
N$94
  Top 0.813: R36.1 153.5,58.37 U$7.P$24
N$95
  Top 0.813: R38.1 160.6,56.69 159.1,58.19 U$7.P$26
N$96
  Top 0.813: U$7.P$28 166.08,56.99 167.18,56.99 167.8,56.37 R40.1
N$97
  Top 0.61: R42.1 163.61,7.98 U$7.P$7
N$98  (1 unrouted)
  Top 0.61: U$7.P$5 166.21,10.46 175.6,10.46 176.3,11.16 176.3,12.26 178.5,14.46 179.4,14.46 | 179.5,14.46 179.8,14.76 R44.1
N$99
  Top 0.61: R46.1 170.1,13.33 U$7.P$3
N$100
  Top 0.61: U$7.P$1 176.6,14.75 R48.1
N$101  (via drill 0.7 pad 1.3)
  Top 0.406: IC21.18 178.2,24.54 178.2,17.9 177.8,17.5 165.1,17.5 164.8,17.8 164.8,18.4 164.1,19.1 | IC19.3 150.62,45.1 v146.9,45.1 | 148.5,19 148.6,19.1
  Top 0.61: v146.9,17.4 148.5,19 | 148.6,19.1 164.1,19.1
  Bottom 0.406: v146.9,45.1 v146.9,17.4
N$102  (via drill 0.7 pad 1.3)
  Top 0.406: IC20.3 132.43,17.77 132.6,17.6 145.1,17.6 145.5,17.2 145.5,16 146.1,15.4 | IC19.18 162.93,45.17 163,45.1 v163.4,45.1
  Top 0.61: v163.4,17.5 161.3,15.4 146.1,15.4
  Bottom 0.406: v163.4,45.1 v163.4,17.5
N$103
  Top 0.406: IC3.3 117.22,32.38 117.74,31.86 132.1,31.9 132.43,32.23 IC20.18
N$104
  Top 0.406: IC1.17 72.73,32.09 71.64,31 68.24,31 64.24,27 64.24,12 65.42,10.82 R56.2
N$105
  Top 0.406: IC1.16 74,32.06 72.14,30.2 68.64,30.2 65.04,26.6 65.04,13.4 66.04,12.4 69.54,12.4 69.94,12 R55.2
N$106
  Top 0.406: IC1.15 75.28,32.03 72.64,29.4 69.04,29.4 66.64,27 R54.2
N$107
  Top 0.406: IC1.14 76.55,32 73.08,28.54 69.48,28.54 67.94,27 67.94,22.3 69.84,20.4 R53.2
N$108
  Top 0.406: R52.2 83.04,19.32 83.04,20.2 81.44,21.8 77.94,21.8 76.55,23.2 IC1.7
N$109
  Top 0.406: R51.2 79.44,20.6 79.14,20.9 77.14,20.9 75.28,22.77 IC1.6
N$110
  Top 0.406: R50.2 76.24,20.32 74,22.56 IC1.5
N$111
  Top 0.406: R49.2 73.04,20.62 72.73,20.93 IC1.4
N$112
  Top 0.406: IC2.4 91.19,43.91 91.54,44.26 91.54,48.16 90.94,48.76 83.94,48.76 81.74,50.96 R57.2
N$113
  Top 0.406: R58.2 85.34,51.06 86.83,49.57 91.23,49.57 92.34,48.46 92.34,43.36 91.54,42.56 89.81,42.56 IC2.5
N$114
  Top 0.406: R59.2 88.94,51.16 89.73,50.37 91.63,50.37 93.14,48.86 93.14,42.76 91.75,41.37 IC2.6
N$115
  Top 0.406: R60.2 92.54,50.56 93.95,49.15 93.95,42.27 91.78,40.09 IC2.7
N$116
  Top 0.406: IC2.14 96.91,40.09 94.74,42.26 94.74,49.16 96.04,50.46 R61.2
N$117
  Top 0.406: IC2.15 97.03,41.37 95.54,42.86 95.54,48.86 97.05,50.37 98.84,50.37 99.64,51.17 R62.2
N$118
  Top 0.406: R63.2 103.24,51.24 101.56,49.56 97.34,49.56 96.34,48.56 96.34,43.56 97.27,42.63 IC2.16
N$119
  Top 0.406: R64.2 106.84,51.24 104.36,48.76 97.74,48.76 97.14,48.16 97.14,44.36 97.59,43.91 IC2.17
N$120
  Top 0.406: IC3.4 115.94,32.35 117.24,31.06 121.34,31.06 124.44,27.96 124.44,14.12 122.04,11.72 R65.2
N$121
  Top 0.406: IC3.5 114.67,32.33 116.74,30.26 120.94,30.26 123.64,27.56 123.64,14.43 121.75,12.54 119.22,12.54 118.74,12.06 R66.2
N$122
  Top 0.406: IC3.6 113.41,32.3 116.24,29.46 120.54,29.46 122.84,27.16 122.84,21.46 122.04,20.66 R67.2
N$123
  Top 0.406: IC3.7 112.14,32.27 115.74,28.66 120.14,28.66 122.04,26.76 122.04,23.56 118.84,20.36 R68.2
N$124
  Top 0.406: IC3.14 112.14,23.05 110.74,21.66 107.24,21.66 105.84,20.26 R69.2
N$125
  Top 0.406: IC3.15 113.41,22.82 111.34,20.76 109.94,20.76 109.14,19.96 R70.2
N$126
  Top 0.406: IC3.16 114.67,22.5 112.44,20.26 R71.2
N$127
  Top 0.406: IC3.17 115.94,20.96 115.64,20.66 R72.2
N$128
  Top 0.406: IC6.3 56.26,32.24 56.6,31.9 71,31.9 71.47,32.37 IC1.18
N$129
  Top 0.61: R49.1 73.04,14.73 U$1.P$16
N$130
  Top 0.61: R51.1 79.44,13.41 U$1.P$14
N$131
  Top 0.406: 70.33,14.41 71.43,14.41
  Top 0.61: U$1.P$12 83.44,10.49 73.85,10.49 73.15,11.19 73.15,12.69 71.43,14.41 70.37,14.41 | R53.1 69.92,16 69.92,14.82 70.33,14.41
N$132  (1 unrouted)
  Top 0.406: 90.52,12.4 U$1.P$10 | 86.23,8 86.36,8.13 | 86.36,8.13
  Top 0.61: R55.1 69.96,8 86.23,8 | 86.36,8.13 90.52,12.29
N$133
  Top 0.813: R57.1 81.74,56.08 82.24,56.58 83.64,56.58 85.44,58.38 U$1.P$21
N$134
  Top 0.406: 90.47,58.84 U$1.P$23
  Top 0.813: R59.1 88.94,57.31 90.47,58.84
N$135
  Top 0.813: R61.1 96.04,56.95 95.6,57.39 U$1.P$25
N$136
  Top 0.406: 100.68,58.7 U$1.P$27
  Top 0.813: R63.1 103.05,55.27 103.05,56.35 100.7,58.7 100.68,58.7
N$137
  Top 0.61: U$1.P$8 101.8,6.29 101.8,6.26 121.34,6.26 122.04,6.96 R65.1
N$138
  Top 0.406: 121.16,13.45 118.04,13.45 116.44,11.85
  Top 0.61: U$1.P$6 103.91,9.26 115.14,9.26 116.44,10.56 116.44,11.85 116.44,11.95 117.94,13.45 118.82,13.45 121.16,13.45 122.04,14.34 R67.1
N$139
  Top 0.406: 105.84,16 R69.1
  Top 0.61: U$1.P$4 105.76,15.92 105.84,16
N$140
  Top 0.406: 112.54,15.98 R71.1
  Top 0.61: 112.54,15.98 112.54,14.76 110.84,13.06 U$1.P$2
N$141
  Top 0.61: R50.1 76.24,14.07 U$1.P$15
N$142
  Top 0.61: U$1.P$13 82.6,12.79 82.6,16.04 R52.1
N$143  (1 unrouted)
  Top 0.406: 71.97,11.97 72.04,11.9
  Top 0.61: 72.04,11.9 72.04,10.4 73.14,9.3 84.79,9.3 U$1.P$11 | R54.1 66.64,14.3 67.53,13.41 67.54,13.41 | 67.54,13.3 70.64,13.3 71.97,11.97
N$144
  Top 0.61: U$1.P$9 86.97,6.4 66.94,6.4 66.64,6.7 R56.1
N$145
  Top 0.813: R58.1 85.34,56.25 U$1.P$22
N$146
  Top 0.813: R60.1 92.54,56.91 93.06,57.43 U$1.P$24
N$147
  Top 0.813: R62.1 99.64,56.69 98.14,58.19 U$1.P$26
N$148
  Top 0.813: U$1.P$28 103.22,58.4 104.84,56.78 106.24,56.78 106.84,56.18 R64.1
N$149
  Top 0.61: R66.1 102.65,7.98 U$1.P$7
N$150
  Top 0.406: U$1.P$5 103.22,12.18
  Top 0.61: 103.22,12.18 104.94,10.46 114.64,10.46 115.34,11.16 115.34,12.26 117.44,14.36 118.44,14.36 118.84,14.76 R68.1
N$151
  Top 0.406: 109.14,15.9 R70.1
  Top 0.61: U$1.P$3 109.14,13.33 109.14,15.9
N$152
  Top 0.61: U$1.P$1 115.64,14.75 R72.1
N$153  (via drill 0.7 pad 1.3)
  Top 0.406: IC3.18 117.24,24.54 117.24,17.9 116.84,17.5 104.14,17.5 103.84,17.8 103.84,18.4 | IC2.3 89.67,45.1 v85.94,45.1
  Top 0.61: v85.94,17.4 87.64,19.1 103.14,19.1 103.84,18.4
  Bottom 0.406: v85.94,45.1 v85.94,17.4
N$154
  Top 0.406: IC4.17 11.78,32.09 10.18,30.5 6.78,30.5 3.28,27 3.28,12 4.46,10.82 R80.2
N$155  (via drill 0.7 pad 1.3)
  Top 0.406: IC1.3 71.47,17.77 71.64,17.6 84.14,17.6 84.42,17.32 | IC2.18 101.97,45.17 102.04,45.1 v102.44,45.1
  Top 0.61: v102.44,17.5 100.34,15.4 85.14,15.4 84.48,16.05 84.48,17.25 84.42,17.32
  Bottom 0.406: v102.44,45.1 v102.44,17.5
N$156
  Top 0.406: IC4.16 13.04,32.06 10.68,29.7 7.18,29.7 4.08,26.6 4.08,13.4 4.88,12.6 8.38,12.6 8.98,12 R79.2
N$157
  Top 0.406: IC4.15 14.31,32.03 11.08,28.8 7.48,28.8 5.68,27 R78.2
N$158
  Top 0.406: IC4.14 15.59,32 11.32,27.74 7.72,27.74 6.98,27 6.98,22.3 8.88,20.4 R77.2
N$159
  Top 0.406: R76.2 22.08,19.32 22.08,20.2 20.48,21.8 16.98,21.8 15.59,23.2 IC4.7
N$160
  Top 0.406: R75.2 18.48,20.6 18.18,20.9 16.18,20.9 14.31,22.77 IC4.6
N$161
  Top 0.406: R74.2 15.28,20.32 13.04,22.56 IC4.5
N$162
  Top 0.406: R73.2 12.08,20.62 11.78,20.93 IC4.4
N$163
  Top 0.406: IC5.4 30.23,43.91 30.58,44.26 30.58,48.16 29.98,48.76 22.98,48.76 20.78,50.96 R81.2
N$164
  Top 0.406: R82.2 24.38,51.06 25.87,49.57 30.27,49.57 31.38,48.46 31.38,43.36 30.58,42.56 28.86,42.56 IC5.5
N$165
  Top 0.406: R83.2 27.98,51.16 28.77,50.37 30.67,50.37 32.18,48.86 32.18,42.76 30.79,41.37 IC5.6
N$166
  Top 0.406: R84.2 31.58,50.56 32.99,49.15 32.99,42.27 30.82,40.09 IC5.7
N$167
  Top 0.406: IC5.14 35.95,40.09 33.78,42.26 33.78,49.16 35.08,50.46 R85.2
N$168
  Top 0.406: IC5.15 36.08,41.37 34.58,42.86 34.58,48.86 36.09,50.37 37.88,50.37 38.68,51.17 R86.2
N$169
  Top 0.406: R87.2 42.28,51.24 40.6,49.56 36.38,49.56 35.38,48.56 35.38,43.56 36.3,42.63 IC5.16
N$170
  Top 0.406: R88.2 45.88,51.24 43.4,48.76 36.78,48.76 36.18,48.16 36.18,44.36 36.63,43.91 IC5.17
N$171
  Top 0.406: IC6.4 54.98,32.35 56.28,31.06 60.38,31.06 63.48,27.96 63.48,14.12 61.08,11.72 R89.2
N$172
  Top 0.406: IC6.5 53.72,32.33 55.78,30.26 59.98,30.26 62.68,27.56 62.68,14.43 60.79,12.54 58.26,12.54 57.78,12.06 R90.2
N$173
  Top 0.406: IC6.6 52.45,32.3 55.28,29.46 59.58,29.46 61.88,27.16 61.88,21.46 61.08,20.66 R91.2
N$174